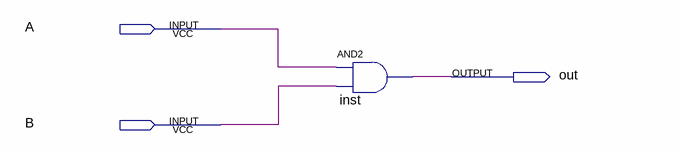
[diagram p0: schematic sheet]
// Quartus schematic first_test.bdf as structural Verilog: 1 symbols, 3 pins
module first_test (
  input  A,
  input  B,
  output out
);

  and inst (out, A, B);
endmodule
